# Altium project gprs_0v1.PrjPCB
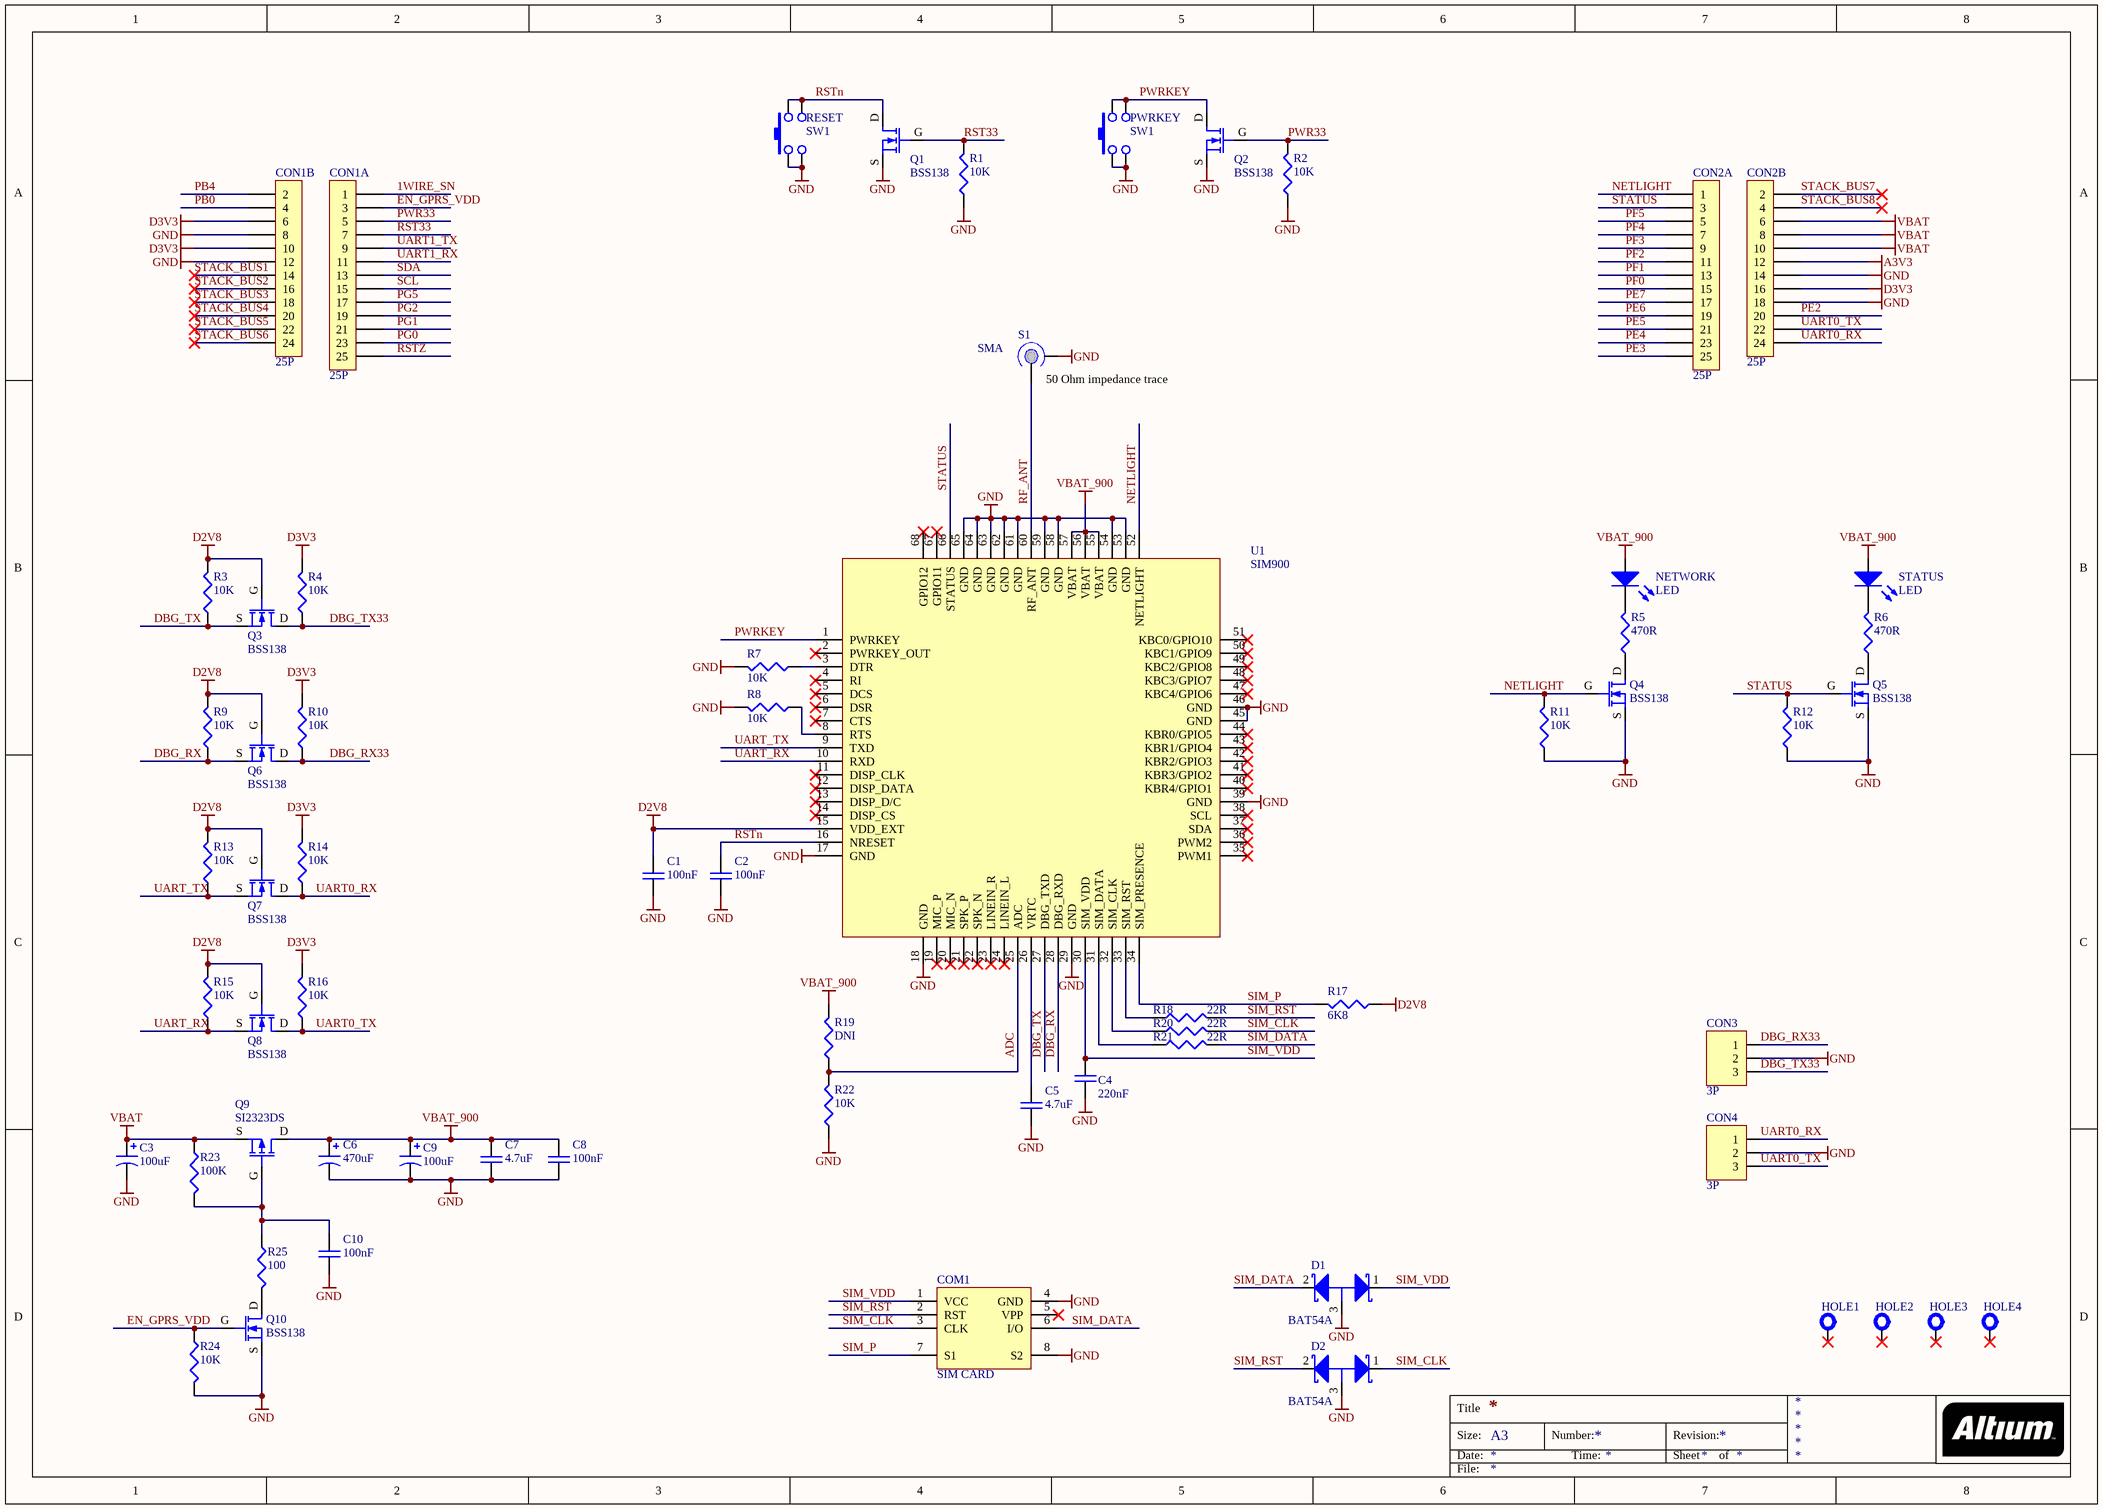
[diagram p0: gprs.SchDoc]
1 sheet, 62 parts. Net scope: global (net labels, ports and power ports of the same name join across sheets).
Board file: gprs_0v1.PcbDoc

## Sheet gprs.SchDoc
size A3

### Parts
C1  100nF  [0603]
C2  100nF  [0603]
C3  100uF  [RADIAL-2.5MM]
C4  220nF  [0603]
C5  4.7uF  [0805]
C6  470uF  [CASE-D]
C7  4.7uF  [0805]
C8  100nF  [0603]
C9  100uF  [RADIAL-2.5MM]
C10  100nF  [0603]
COM1  SIM CARD  [SIMCARD-8]
CON1  25P  [DF9-25-MIRROR]  (parts A,B of 2)
CON2  25P  [DF9-25-MIRROR]  (parts A,B of 2)
CON3  3P  [SIP-3]
CON4  3P  [SIP-3]
D1  BAT54A  [SOT-23]
D2  BAT54A  [SOT-23]
HOLE1  HOLE  [NPTH-3MM]  (value not drawn)  (no BOM)
HOLE2  HOLE  [NPTH-3MM]  (value not drawn)  (no BOM)
HOLE3  HOLE  [NPTH-3MM]  (value not drawn)  (no BOM)
HOLE4  HOLE  [NPTH-3MM]  (value not drawn)  (no BOM)
NETWORK  LED  [0805@DIODE]
PWRKEY  SW1  [MICROSWITCH]
Q1  BSS138  [SOT-23@GSD]
Q2  BSS138  [SOT-23@GSD]
Q3  BSS138  [SOT-23@GSD]
Q4  BSS138  [SOT-23@GSD]
Q5  BSS138  [SOT-23@GSD]
Q6  BSS138  [SOT-23@GSD]
Q7  BSS138  [SOT-23@GSD]
Q8  BSS138  [SOT-23@GSD]
Q9  SI2323DS  [SOT-23@GSD]
Q10  BSS138  [SOT-23@GSD]
R1  10K  [0603]
R2  10K  [0603]
R3  10K  [0603]
R4  10K  [0603]
R5  470R  [0603]
R6  470R  [0603]
R7  10K  [0603]
R8  10K  [0603]
R9  10K  [0603]
R10  10K  [0603]
R11  10K  [0603]
R12  10K  [0603]
R13  10K  [0603]
R14  10K  [0603]
R15  10K  [0603]
R16  10K  [0603]
R17  6K8  [0603]
R18  22R  [0603]
R19  DNI  [0603]
R20  22R  [0603]
R21  22R  [0603]
R22  10K  [0603]
R23  100K  [0603]
R24  10K  [0603]
R25  100  [0603]
RESET  SW1  [MICROSWITCH]
S1  SMA  [SMA-JOHNSON-SCREW]
STATUS  LED  [0805@DIODE]
U1  SIM900  [SIM900]

### Nets
A3V3: CON2.12
D2V8: C1.2 Q3.G Q6.G Q7.G Q8.G R3.2 R9.2 R13.2 R15.2 R17.1 U1.15(VDD_EXT)
D3V3: CON1.6 CON1.10 CON2.16 R4.2 R10.2 R14.2 R16.2
GND: C1.1 C2.1 C3.2(N) C4.1 C5.1 C6.2(N) C7.1 C8.1 C9.2(N) C10.1 COM1.4(GND) COM1.8(S2) CON1.8 CON1.12 CON2.14 CON2.18 CON3.2 CON4.2 D1.3(K) D2.3(K) PWRKEY.1 PWRKEY.3 Q1.S Q2.S Q4.S Q5.S Q10.S R1.1 R2.1 R7.2 R8.2 R11.1 R12.1 R22.1 R24.2 RESET.1 RESET.3 S1.2(GND) U1.17(GND) U1.18(GND) U1.29(GND) U1.39(GND) U1.45(GND) U1.46(GND) U1.53(GND) U1.54(GND) U1.58(GND) U1.59(GND) U1.61(GND) U1.62(GND) U1.63(GND) U1.64(GND) U1.65(GND)
VBAT: C3.1(P) CON2.6 CON2.8 CON2.10 Q9.S R23.1
VBAT_900: C6.1(P) C7.2 C8.2 C9.1(P) NETWORK.A Q9.D R19.2 STATUS.A U1.55(VBAT) U1.56(VBAT) U1.57(VBAT)
1WIRE_SN: CON1.1
ADC: R19.1 R22.2 U1.25(ADC)
DBG_RX: Q6.S R9.1 U1.28(DBG_RXD)
DBG_RX33: CON3.1 Q6.D R10.1
DBG_TX: Q3.S R3.1 U1.27(DBG_TXD)
DBG_TX33: CON3.3 Q3.D R4.1
EN_GPRS_VDD: CON1.3 Q10.G R24.1
NETLIGHT: CON2.1 Q4.G R11.2 U1.52(NETLIGHT)
PB0: CON1.4
PB4: CON1.2
PE2: CON2.20
PE3: CON2.25
PE4: CON2.23
PE5: CON2.21
PE6: CON2.19
PE7: CON2.17
PF0: CON2.15
PF1: CON2.13
PF2: CON2.11
PF3: CON2.9
PF4: CON2.7
PF5: CON2.5
PG0: CON1.23
PG1: CON1.21
PG2: CON1.19
PG5: CON1.17
PWR33: CON1.5 Q2.G R2.2
PWRKEY: PWRKEY.2 PWRKEY.4 Q2.D U1.1(PWRKEY)
RF_ANT: S1.1(SIG) U1.60(RF_ANT)
RST33: CON1.7 Q1.G R1.2
RSTn: C2.2 Q1.D RESET.2 RESET.4 U1.16(NRESET)
RSTZ: CON1.25
SCL: CON1.15
SDA: CON1.13
SIM_CLK: COM1.3(CLK) D2.1(A1) R20.2
SIM_DATA: COM1.6(I/O) D1.2(A2) R21.2
SIM_P: COM1.7(S1) R17.2 U1.34(SIM_PRESENCE)
SIM_RST: COM1.2(RST) D2.2(A2) R18.2
SIM_VDD: C4.2 COM1.1(VCC) D1.1(A1) U1.30(SIM_VDD)
STACK_BUS1: CON1.14
STACK_BUS2: CON1.16
STACK_BUS3: CON1.18
STACK_BUS4: CON1.20
STACK_BUS5: CON1.22
STACK_BUS6: CON1.24
STACK_BUS7: CON2.2
STACK_BUS8: CON2.4
STATUS: CON2.3 Q5.G R12.2 U1.66(STATUS)
UART0_RX: CON2.24 CON4.1 Q7.D R14.1
UART0_TX: CON2.22 CON4.3 Q8.D R16.1
UART1_RX: CON1.11
UART1_TX: CON1.9
UART_RX: Q8.S R15.1 U1.10(RXD)
UART_TX: Q7.S R13.1 U1.9(TXD)
NetC5_2: C5.2 U1.26(VRTC)
NetC10_2: C10.2 Q9.G R23.2 R25.1
NetNETWORK_K: NETWORK.K R5.2
NetQ4_D: Q4.D R5.1
NetQ5_D: Q5.D R6.1
NetQ10_D: Q10.D R25.2
NetR6_2: R6.2 STATUS.K
NetR7_1: R7.1 U1.3(DTR)
NetR8_1: R8.1 U1.8(RTS)
NetR18_1: R18.1 U1.33(SIM_RST)
NetR20_1: R20.1 U1.32(SIM_CLK)
NetR21_1: R21.1 U1.31(SIM_DATA)

Not connected (* = marked no-connect by the designer): COM1 5(VPP)*; HOLE1 1(TP)*; HOLE2 1(TP)*; HOLE3 1(TP)*; HOLE4 1(TP)*; U1 2(PWRKEY_OUT)* 4(RI)* 5(DCS)* 6(DSR)* 7(CTS)* 11(DISP_CLK)* 12(DISP_DATA)* 13(DISP_D/C)* 14(DISP_CS)* 19(MIC_P)* 20(MIC_N)* 21(SPK_P)* 22(SPK_N)* 23(LINEIN_R)* 24(LINEIN_L)* 35(PWM1)* 36(PWM2)* 37(SDA)* 38(SCL)* 40(KBR4/GPIO1)* 41(KBR3/GPIO2)* 42(KBR2/GPIO3)* 43(KBR1/GPIO4)* 44(KBR0/GPIO5)* 47(KBC4/GPIO6)* 48(KBC3/GPIO7)* 49(KBC2/GPIO8)* 50(KBC1/GPIO9)* 51(KBC0/GPIO10)* 67(GPIO11)* 68(GPIO12)*

### Notes on the sheet
- (near S1) 50 Ohm impedance trace
- Title
- Size:
- Date:
- A3
- Number:
- Time:
- Revision:
- Sheet
- of
- File:

### Library data of the parts
C1 C2 C4 C5 C7 C8 C10 = CAP: Capacitor; Owner: Nuno Brum; Sub-Type: Ceramic; Assembly: INS; Maximum Voltage: *; Creation Date: 2005-04-28; Status: Valid; Validation date: 2006-05-15; Type: Capacitor
C3 C9 = CAP POL: Polarized Capacitor; Owner: Nuno Brum; Sub-Type: Tantalum; Assembly: INS; Validation date: 2006-05-15; Creation Date: 2005-04-28; Status: Valid; Type: Capacitor
C6 = CAP POL: Polarized Capacitor; pin to pad: N>2 P>1; Owner: Nuno Brum; Sub-Type: Tantalum; Assembly: INS; Validation date: 2006-05-15; Creation Date: 2005-04-28; Status: Valid; Type: Capacitor
COM1 = SIMCARD: SIMCARD holder; Manufacturer REF: SF7W008S1AE900; Manufacturer: JAE Electronics; Mouser REF: 656-SF7W008S1AE900
CON1 CON2 = CON25: Connector 25 Pins; Owner: Ricardo Rodrigues; Assembly: INS; Sub-Type: Connector; Creation Date: 2013-01-13; Status: Valid; Validation Date: 2012-01-13; Type: Electrical & Mechanical
CON3 CON4 = CON03: Connector 3 pins; Owner: Rui Rebelo; Assembly: INS; Sub-Type: Connector; Creation Date: 2005-05-27; Status: Valid; Validation Date: 2006-05-15; Type: Electrical & Mechanical
D1 D2 = BAT54A: Dual Schottky Barrier Diode; Assembly: INS; Owner: Luis Alves; Creation Date: 2007-10-11; Status: New; Sub-Type: Schottky; Type: Diode
HOLE1-HOLE4 = PCB HOLE: PCB Fixation Hole M3; Owner: Nuno Brum; Sub-Type: Mechanical; Type: PCB; Creation Date: 2005-06-01; Status: Valid; Validation Date: 2006-05-15; Assembly: PCB
NETWORK STATUS = LED: Light emitting diode; Owner: Nuno Brum; Assembly: INS; Creation Date: 2001-06-05; Sub-Type: LED; Status: Valid; Validation date: 2006-05-15; Model: LED; Type: Diode
PWRKEY RESET = SW1: Switch Push Button; Owner: Nuno Brum; Assembly: INS; Validation Date: 2006-05-15; Sub-Type: Switch; Creation Date: 2002-07-17; Status: Valid; Type: Electrical & Mechanical
Q1-Q8 Q10 = MOSFET-N: N-Channel Logic Level Enhancement Mode Field Effect Transistor; pin to pad: 2>3 3>2; Owner: Nuno Brum; Sub-Type: MOSFET; Assembly: INS; Creation Date: 2001-06-05; Status: Valid; Model: BSS138; Type: Transistor
Q9 = MOSFET-P: P-Channel Logic Level Enhancement Mode Field Effect Transistor; Owner: Nuno Brum; Sub-Type: MOSFET; Assembly: INS; Validation date: 2006-05-15; Creation Date: 2001-06-05; Status: Valid; Model: SI2323DS; Type: Transistor
R1-R25 = RES: Resistor; Owner: Nuno Brum; Sub-Type: Generic; Assembly: INS; Validation date: 2006-05-15; Creation Date: 2002-07-17; Status: Valid; Power: *; Type: Resistor
S1 = SMA: SMA to PCB - Coaxial connector; Owner: Nuno Brum; Assembly: INS; Validation Date: 2006-05-15; Sub-Type: Connector; Creation Date: 2002-07-17; Status: Valid; Type: Electrical & Mechanical